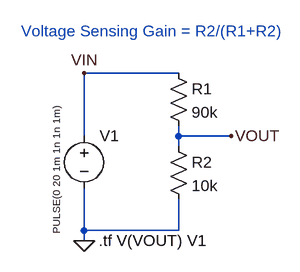
[diagram p0: schematic Voltage Divide Transfer Function.asc]
Voltage Divide Transfer Function.asc, the LTspice schematic file:
Version 4
SHEET 1 880 680
WIRE 128 80 -16 80
WIRE -16 176 -16 80
WIRE 128 176 128 160
WIRE 208 176 128 176
WIRE 128 192 128 176
WIRE -16 320 -16 256
WIRE 128 320 128 272
WIRE 128 320 -16 320
WIRE -16 336 -16 320
FLAG -16 336 0
FLAG -16 80 VIN
FLAG 208 176 VOUT
SYMBOL voltage -16 160 R0
WINDOW 3 -42 -28 VRight 1
WINDOW 123 0 0 Left 0
WINDOW 39 0 0 Left 0
SYMATTR Value PULSE(0 20 1m 1n 1n 1m)
SYMATTR InstName V1
SYMBOL res 112 64 R0
SYMATTR InstName R1
SYMATTR Value 90k
SYMBOL res 112 176 R0
SYMATTR InstName R2
SYMATTR Value 10k
TEXT -112 16 Left 2 ;Voltage Sensing Gain = R2/(R1+R2)
TEXT 6 336 Left 2 !.tf V(VOUT) V1

The netlist it stands for:
* Voltage Divide Transfer Function.asc
V1 VIN 0 PULSE(0 20 1m 1n 1n 1m)
R1 VIN VOUT 90k
R2 VOUT 0 10k
* Voltage Sensing Gain = R2/(R1+R2)
.tf V(VOUT) V1
.backanno
.end